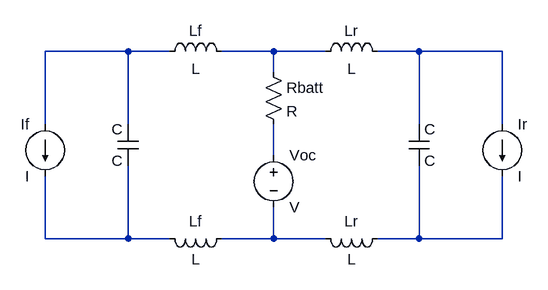
[diagram p0: schematic Circuit Model.asc]
Circuit Model.asc, the LTspice schematic file:
Version 4
SHEET 1 880 680
WIRE -240 -160 -368 -160
WIRE -176 -160 -240 -160
WIRE -16 -160 -96 -160
WIRE 64 -160 -16 -160
WIRE 208 -160 144 -160
WIRE 336 -160 208 -160
WIRE -16 -128 -16 -160
WIRE -368 -48 -368 -160
WIRE -240 -48 -240 -160
WIRE 208 -48 208 -160
WIRE 336 -48 336 -160
WIRE -16 0 -16 -48
WIRE -368 128 -368 32
WIRE -240 128 -240 16
WIRE -240 128 -368 128
WIRE -176 128 -240 128
WIRE -16 128 -16 80
WIRE -16 128 -96 128
WIRE 64 128 -16 128
WIRE 208 128 208 16
WIRE 208 128 144 128
WIRE 336 128 336 32
WIRE 336 128 208 128
SYMBOL voltage -16 -16 R0
SYMATTR InstName Voc
SYMBOL res -32 -144 R0
SYMATTR InstName Rbatt
SYMBOL ind 48 -144 R270
WINDOW 0 32 56 VTop 2
WINDOW 3 5 56 VBottom 2
SYMATTR InstName Lr
SYMBOL cap 192 -48 R0
SYMATTR InstName C
SYMBOL current 336 -48 R0
SYMATTR InstName Ir
SYMBOL ind 160 112 R90
WINDOW 0 5 56 VBottom 2
WINDOW 3 32 56 VTop 2
SYMATTR InstName Lr
SYMBOL ind -80 -144 M270
WINDOW 0 32 56 VTop 2
WINDOW 3 5 56 VBottom 2
SYMATTR InstName Lf
SYMBOL cap -224 -48 M0
SYMATTR InstName C
SYMBOL current -368 -48 M0
SYMATTR InstName If
SYMBOL ind -192 112 M90
WINDOW 0 5 56 VBottom 2
WINDOW 3 32 56 VTop 2
SYMATTR InstName Lf

The netlist it stands for:
* Circuit Model.asc
Voc N004 N006 V
Rbatt N002 N004 R
Lr N002 N003 L
C N003 N007 C
Ir N003 N007 I
Lr N007 N006 L
Lf N002 N001 L
C N001 N005 C
If N001 N005 I
Lf N005 N006 L
.backanno
.end